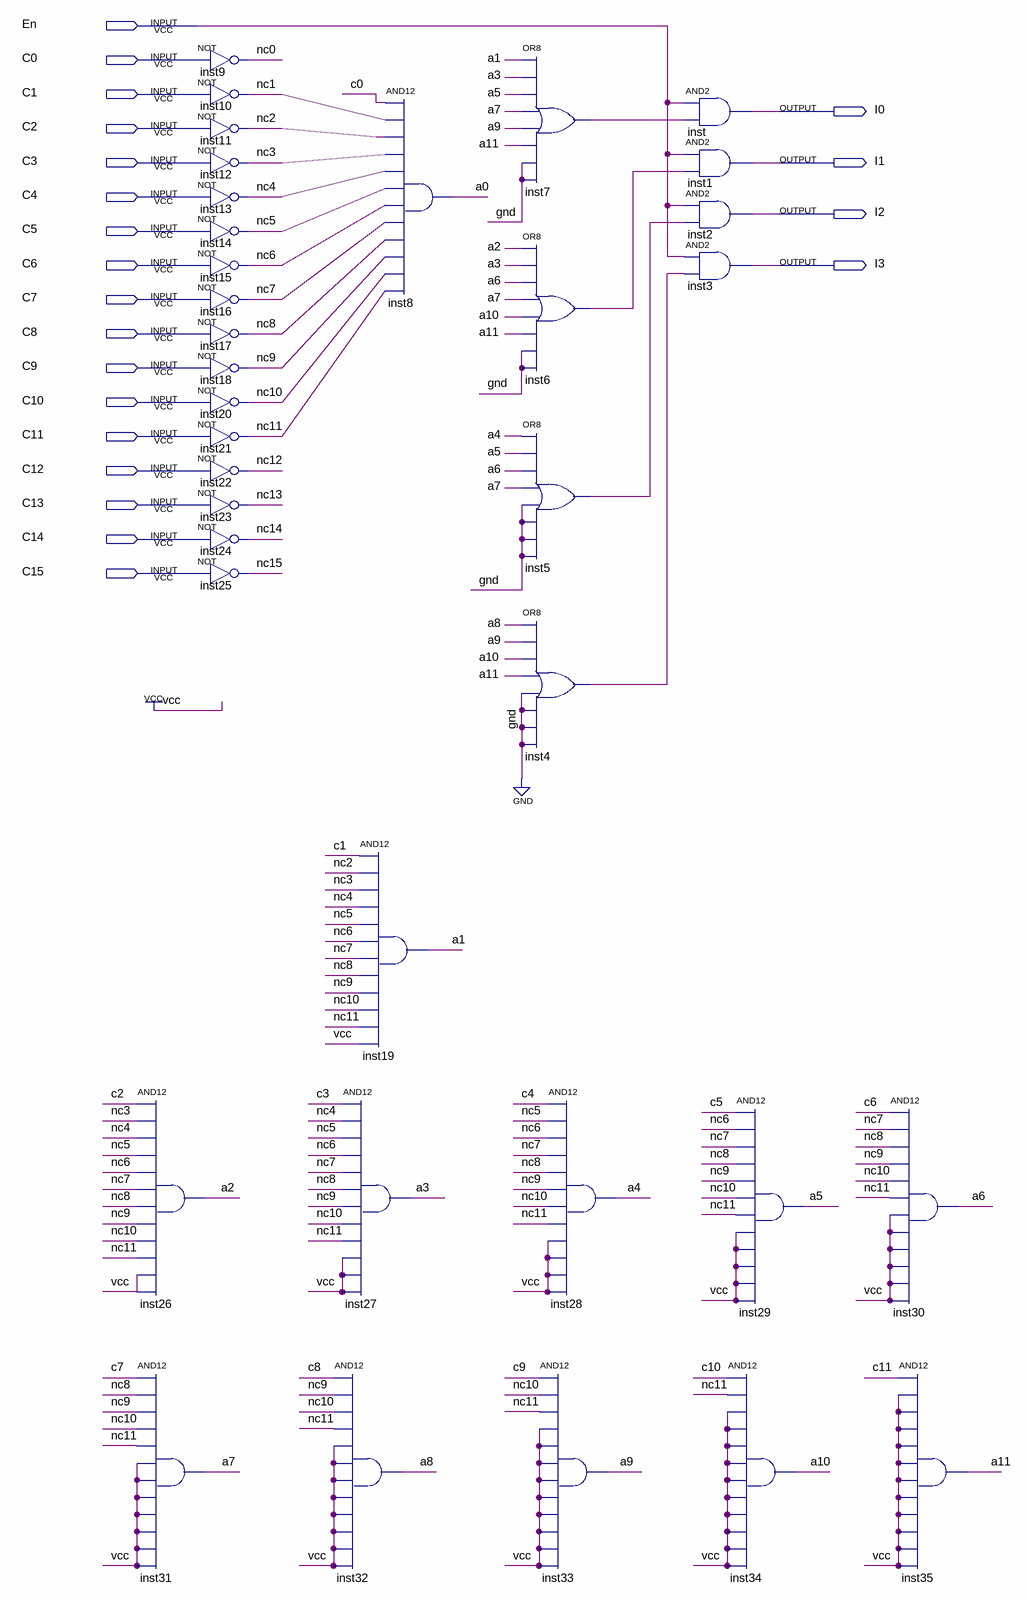
[diagram p0: schematic sheet]
// Quartus schematic CD16.bdf as structural Verilog: 36 symbols, 21 pins
module CD16 (
  input  En,
  input  C0,
  input  C1,
  input  C2,
  input  C3,
  input  C4,
  input  C5,
  input  C6,
  input  C7,
  input  C8,
  input  C9,
  input  C10,
  input  C11,
  input  C12,
  input  C13,
  input  C14,
  input  C15,
  output I0,
  output I1,
  output I2,
  output I3
);

  wire a0, a1, a2, a3, a4, a5, a6, a7, a8, a9, a10, a11, inst4_out, inst5_out, inst6_out, inst7_out, nc0,
       nc1, nc2, nc3, nc4, nc5, nc6, nc7, nc8, nc9, nc10, nc11, nc12, nc13, nc14, nc15;

  and inst26 (a2, C2, nc3, nc4, nc5, nc6, nc7, nc8, nc9, nc10, nc11, 1'b1, 1'b1);
  and inst31 (a7, C7, nc8, nc9, nc10, nc11, 1'b1, 1'b1, 1'b1, 1'b1, 1'b1, 1'b1, 1'b1);
  not inst9 (nc0, C0);
  not inst10 (nc1, C1);
  not inst11 (nc2, C2);
  not inst12 (nc3, C3);
  not inst13 (nc4, C4);
  not inst14 (nc5, C5);
  not inst15 (nc6, C6);
  not inst16 (nc7, C7);
  not inst17 (nc8, C8);
  not inst18 (nc9, C9);
  not inst20 (nc10, C10);
  not inst21 (nc11, C11);
  not inst22 (nc12, C12);
  not inst23 (nc13, C13);
  not inst24 (nc14, C14);
  not inst25 (nc15, C15);
  and inst8 (a0, C0, nc1, nc2, nc3, nc4, nc5, nc6, nc7, nc8, nc9, nc10, nc11);
  and inst19 (a1, C1, nc2, nc3, nc4, nc5, nc6, nc7, nc8, nc9, nc10, nc11, 1'b1);
  and inst27 (a3, C3, nc4, nc5, nc6, nc7, nc8, nc9, nc10, nc11, 1'b1, 1'b1, 1'b1);
  and inst32 (a8, C8, nc9, nc10, nc11, 1'b1, 1'b1, 1'b1, 1'b1, 1'b1, 1'b1, 1'b1, 1'b1);
  or inst7 (inst7_out, a1, a3, a5, a7, a9, a11, 1'b0, 1'b0);
  or inst6 (inst6_out, a2, a3, a6, a7, a10, a11, 1'b0, 1'b0);
  or inst5 (inst5_out, a4, a5, a6, a7, 1'b0, 1'b0, 1'b0, 1'b0);
  or inst4 (inst4_out, a8, a9, a10, a11, 1'b0, 1'b0, 1'b0, 1'b0);
  and inst28 (a4, C4, nc5, nc6, nc7, nc8, nc9, nc10, nc11, 1'b1, 1'b1, 1'b1, 1'b1);
  and inst33 (a9, C9, nc10, nc11, 1'b1, 1'b1, 1'b1, 1'b1, 1'b1, 1'b1, 1'b1, 1'b1, 1'b1);
  and inst (I0, En, inst7_out);
  and inst1 (I1, En, inst6_out);
  and inst2 (I2, En, inst5_out);
  and inst3 (I3, En, inst4_out);
  and inst29 (a5, C5, nc6, nc7, nc8, nc9, nc10, nc11, 1'b1, 1'b1, 1'b1, 1'b1, 1'b1);
  and inst34 (a10, C10, nc11, 1'b1, 1'b1, 1'b1, 1'b1, 1'b1, 1'b1, 1'b1, 1'b1, 1'b1, 1'b1);
  and inst30 (a6, C6, nc7, nc8, nc9, nc10, nc11, 1'b1, 1'b1, 1'b1, 1'b1, 1'b1, 1'b1);
  and inst35 (a11, C11, 1'b1, 1'b1, 1'b1, 1'b1, 1'b1, 1'b1, 1'b1, 1'b1, 1'b1, 1'b1, 1'b1);
endmodule
